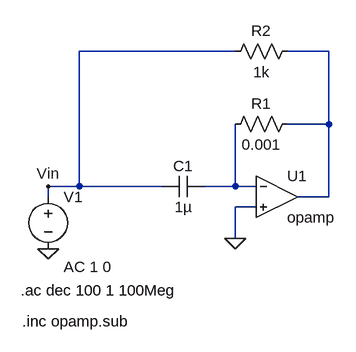
[diagram p0: schematic ejer3a.asc]
ejer3a.asc, the LTspice schematic file:
Version 4
SHEET 1 880 680
WIRE 112 16 -128 16
WIRE 256 16 192 16
WIRE 256 128 256 16
WIRE 256 128 192 128
WIRE -128 224 -128 16
WIRE -128 224 -176 224
WIRE 0 224 -128 224
WIRE 112 224 112 128
WIRE 112 224 64 224
WIRE 144 224 112 224
WIRE -176 240 -176 224
WIRE 256 240 256 128
WIRE 256 240 208 240
WIRE 144 256 112 256
WIRE 112 304 112 256
FLAG -176 320 0
FLAG 112 304 0
FLAG -176 224 Vin
SYMBOL res 208 112 R90
WINDOW 0 0 56 VBottom 2
WINDOW 3 32 56 VTop 2
SYMATTR InstName R1
SYMATTR Value 0.001
SYMBOL res 208 0 R90
WINDOW 0 0 56 VBottom 2
WINDOW 3 32 56 VTop 2
SYMATTR InstName R2
SYMATTR Value 1k
SYMBOL cap 64 208 R90
WINDOW 0 0 32 VBottom 2
WINDOW 3 32 32 VTop 2
SYMATTR InstName C1
SYMATTR Value 1µ
SYMBOL OpAmps\\opamp 176 176 R0
SYMATTR InstName U1
SYMATTR SpiceLine Aol=1000000Meg
SYMATTR SpiceLine2 GBW=1000000Meg
SYMBOL voltage -176 224 R0
WINDOW 123 24 124 Left 2
WINDOW 39 0 0 Left 0
SYMATTR InstName V1
SYMATTR Value ""
SYMATTR Value2 AC 1 0
TEXT -218 384 Left 2 !.ac dec 100 1 100Meg
TEXT -216 432 Left 2 !.inc opamp.sub

The netlist it stands for:
* ejer3a.asc
R1 N001 N002 0.001
R2 N001 Vin 1k
C1 N002 Vin 1µ
XU1 N002 0 N001 opamp Aol=1000000Meg GBW=1000000Meg  ; pins invin noninvin out
V1 Vin 0 AC 1 0
.ac dec 100 1 100Meg
.inc opamp.sub
.backanno
.end